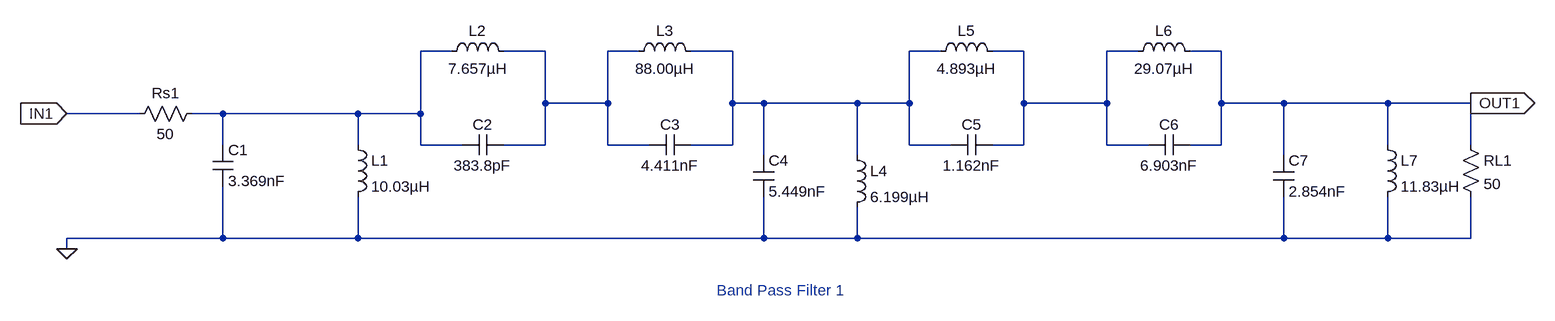
[diagram p0: schematic BPF1.asc]
BPF1.asc, the LTspice schematic file:
Version 4
SHEET 1 1212 680
WIRE -480 48 -528 48
WIRE -336 48 -400 48
WIRE -192 48 -240 48
WIRE -48 48 -112 48
WIRE 272 48 224 48
WIRE 400 48 352 48
WIRE 576 48 528 48
WIRE 704 48 656 48
WIRE -336 128 -336 48
WIRE -240 128 -240 48
WIRE -240 128 -336 128
WIRE -48 128 -48 48
WIRE 0 128 -48 128
WIRE 144 128 0 128
WIRE 224 128 224 48
WIRE 224 128 144 128
WIRE 400 128 400 48
WIRE 528 128 528 48
WIRE 528 128 400 128
WIRE 704 128 704 48
WIRE 800 128 704 128
WIRE 960 128 800 128
WIRE 1088 128 960 128
WIRE -960 144 -1072 144
WIRE -832 144 -880 144
WIRE -624 144 -832 144
WIRE -528 144 -528 48
WIRE -528 144 -624 144
WIRE -832 192 -832 144
WIRE -624 192 -624 144
WIRE -528 192 -528 144
WIRE -464 192 -528 192
WIRE -336 192 -336 128
WIRE -336 192 -400 192
WIRE -240 192 -240 128
WIRE -176 192 -240 192
WIRE -48 192 -48 128
WIRE -48 192 -112 192
WIRE 224 192 224 128
WIRE 288 192 224 192
WIRE 400 192 400 128
WIRE 400 192 352 192
WIRE 528 192 528 128
WIRE 592 192 528 192
WIRE 704 192 704 128
WIRE 704 192 656 192
WIRE 960 192 960 128
WIRE 1088 192 1088 128
WIRE 0 208 0 128
WIRE 144 208 144 128
WIRE 800 208 800 128
WIRE -832 336 -832 256
WIRE -832 336 -1072 336
WIRE -624 336 -624 272
WIRE -624 336 -832 336
WIRE 0 336 0 272
WIRE 0 336 -624 336
WIRE 144 336 144 288
WIRE 144 336 0 336
WIRE 800 336 800 272
WIRE 800 336 144 336
WIRE 960 336 960 272
WIRE 960 336 800 336
WIRE 1088 336 1088 272
WIRE 1088 336 960 336
WIRE -1072 352 -1072 336
FLAG -1072 352 0
FLAG 1088 128 OUT1
IOPIN 1088 128 Out
FLAG -1072 144 IN1
IOPIN -1072 144 In
SYMBOL res -864 128 R90
WINDOW 0 0 56 VBottom 2
WINDOW 3 32 56 VTop 2
SYMATTR InstName Rs1
SYMATTR Value 50
SYMBOL cap -848 192 R0
SYMATTR InstName C1
SYMATTR Value 3.369nF
SYMBOL ind -640 176 R0
SYMATTR InstName L1
SYMATTR Value 10.03µH
SYMBOL ind -496 64 R270
WINDOW 0 32 56 VTop 2
WINDOW 3 5 56 VBottom 2
SYMATTR InstName L2
SYMATTR Value 7.657µH
SYMBOL cap -400 176 R90
WINDOW 0 0 32 VBottom 2
WINDOW 3 32 32 VTop 2
SYMATTR InstName C2
SYMATTR Value 383.8pF
SYMBOL ind -208 64 R270
WINDOW 0 32 56 VTop 2
WINDOW 3 5 56 VBottom 2
SYMATTR InstName L3
SYMATTR Value 88.00µH
SYMBOL cap -176 208 R270
WINDOW 0 32 32 VTop 2
WINDOW 3 0 32 VBottom 2
SYMATTR InstName C3
SYMATTR Value 4.411nF
SYMBOL cap -16 208 R0
SYMATTR InstName C4
SYMATTR Value 5.449nF
SYMBOL ind 128 192 R0
SYMATTR InstName L4
SYMATTR Value 6.199µH
SYMBOL ind 256 64 R270
WINDOW 0 32 56 VTop 2
WINDOW 3 5 56 VBottom 2
SYMATTR InstName L5
SYMATTR Value 4.893µH
SYMBOL cap 352 176 R90
WINDOW 0 0 32 VBottom 2
WINDOW 3 32 32 VTop 2
SYMATTR InstName C5
SYMATTR Value 1.162nF
SYMBOL ind 560 64 R270
WINDOW 0 32 56 VTop 2
WINDOW 3 5 56 VBottom 2
SYMATTR InstName L6
SYMATTR Value 29.07µH
SYMBOL cap 592 208 R270
WINDOW 0 32 32 VTop 2
WINDOW 3 0 32 VBottom 2
SYMATTR InstName C6
SYMATTR Value 6.903nF
SYMBOL cap 784 208 R0
SYMATTR InstName C7
SYMATTR Value 2.854nF
SYMBOL ind 944 176 R0
SYMATTR InstName L7
SYMATTR Value 11.83µH
SYMBOL res 1072 176 R0
SYMATTR InstName RL1
SYMATTR Value 50
TEXT -72 416 Left 2 ;Band Pass Filter 1

The netlist it stands for:
* BPF1.asc
Rs1 N001 IN1 50
C1 N001 0 3.369nF
L1 N001 0 10.03µH
L2 N001 N002 7.657µH
C2 N002 N001 383.8pF
L3 N002 N003 88.00µH
C3 N002 N003 4.411nF
C4 N003 0 5.449nF
L4 N003 0 6.199µH
L5 N003 N004 4.893µH
C5 N004 N003 1.162nF
L6 N004 OUT1 29.07µH
C6 N004 OUT1 6.903nF
C7 OUT1 0 2.854nF
L7 OUT1 0 11.83µH
RL1 OUT1 0 50
* Band Pass Filter 1
.backanno
.end